# Altium schematic sheet 13_ACODEC.SchDoc: P30L
size A2; Organization: 六零加智能科技; Address4: www.nidone.com.cn; DocumentNumber: kang jin; Revision: 1.0; SheetNumber: 13; SheetTotal: 23
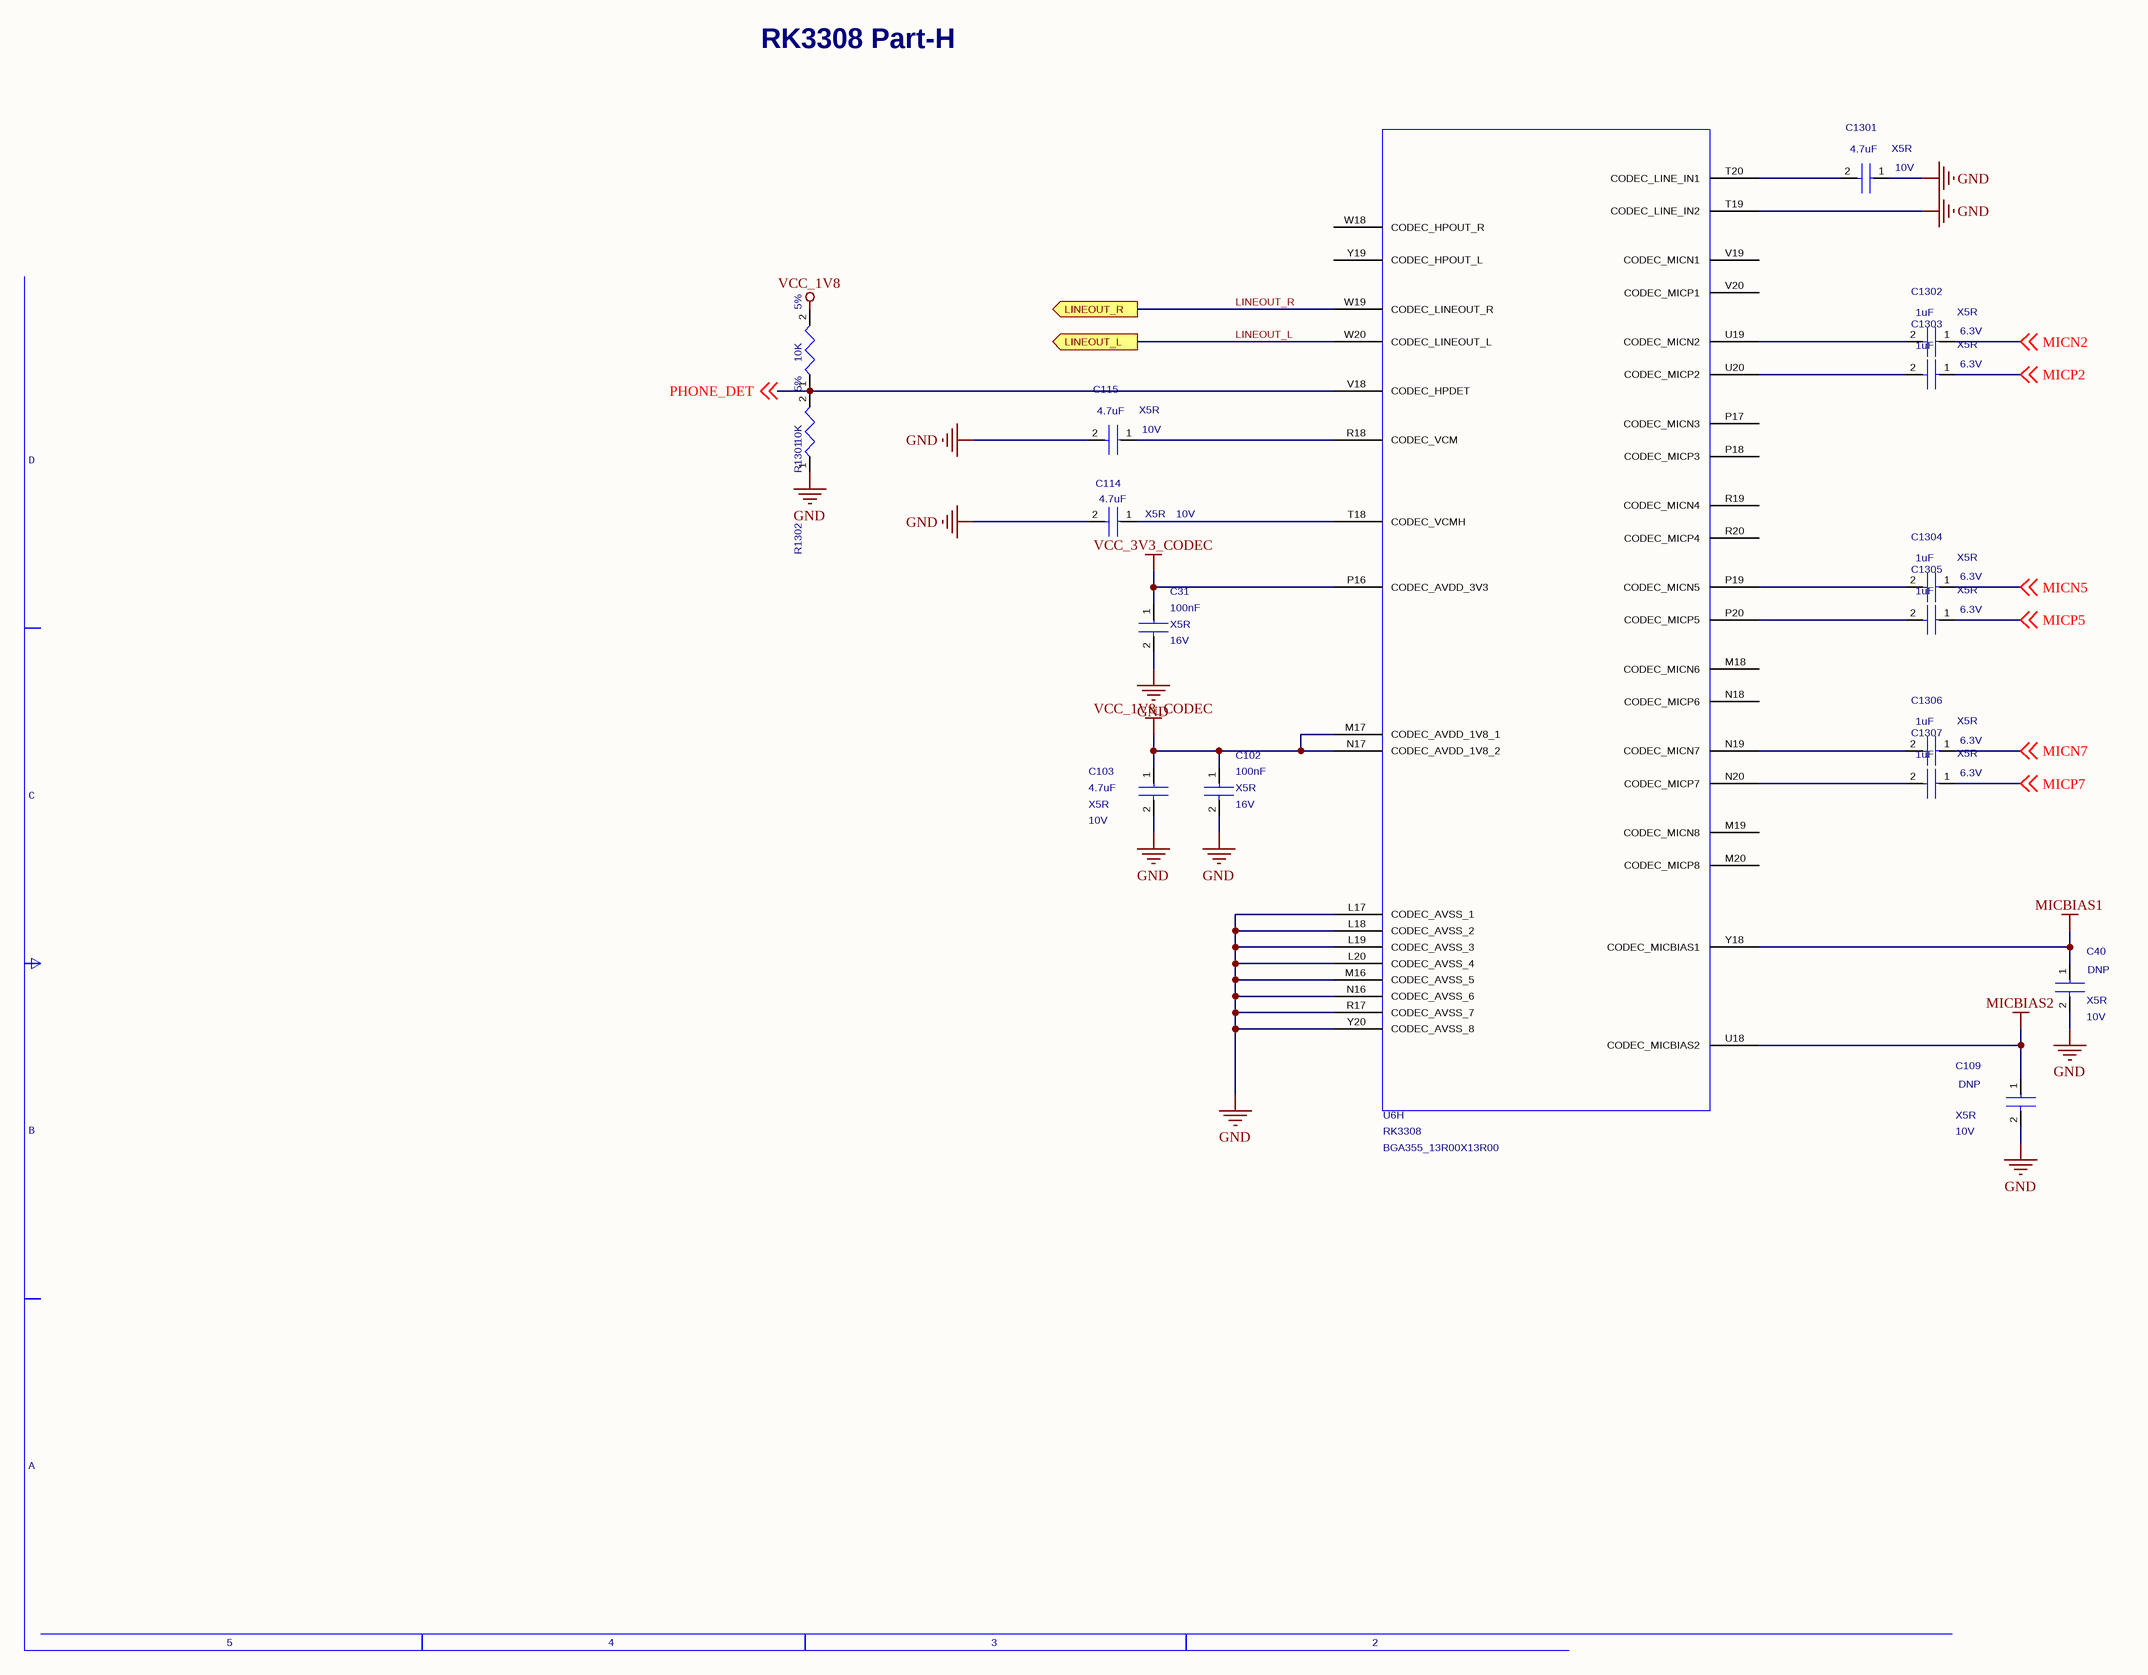
[diagram p0: 13_ACODEC.SchDoc]

## Parts
C31  value 100nF  Voltage: 16V  Dielectric: X5R  [C0402]  (hidden comment: CAP_NP_2)
C40  Dielectric: X5R  Voltage: 10V  Option: DNP  [C0402]  (hidden comment: CAP_NP_2)
C102  value 100nF  Dielectric: X5R  Voltage: 16V  [C0402]  (hidden comment: CAP_NP_2)
C103  value 4.7uF  Dielectric: X5R  Voltage: 10V  [C0402]  (hidden comment: CAP_NP_2)
C109  Voltage: 10V  Dielectric: X5R  Option: DNP  [C0402]  (hidden comment: CAP_NP_2)
C114  value 4.7uF  Voltage: 10V  Dielectric: X5R  [C0603]  (hidden comment: CAP_NP_2)
C115  value 4.7uF  Voltage: 10V  Dielectric: X5R  [C0603]  (hidden comment: CAP_NP_2)
C1301  value 4.7uF  Voltage: 10V  Dielectric: X5R  [C0603]  (hidden comment: CAP_NP_2)
C1302  value 1uF  Voltage: 6.3V  Dielectric: X5R  [C0402]  (hidden comment: CAP_NP_2)
C1303  value 1uF  Voltage: 6.3V  Dielectric: X5R  [C0402]  (hidden comment: CAP_NP_2)
C1304  value 1uF  Voltage: 6.3V  Dielectric: X5R  [C0402]  (hidden comment: CAP_NP_2)
C1305  value 1uF  Voltage: 6.3V  Dielectric: X5R  [C0402]  (hidden comment: CAP_NP_2)
C1306  value 1uF  Voltage: 6.3V  Dielectric: X5R  [C0402]  (hidden comment: CAP_NP_2)
C1307  value 1uF  Voltage: 6.3V  Dielectric: X5R  [C0402]  (hidden comment: CAP_NP_2)
R1301  value 10K  Tolerance: 5%  [R0402]  (hidden comment: RESISTOR)
R1302  value 10K  Tolerance: 5%  [R0402]  (hidden comment: RESISTOR)
U6  RK3308  [BGA355_13R00X13R00]  (part H of 14)

## Ports
LINEOUT_L (out), LINEOUT_R (out)

## Nets
GND: C31.2 C40.2 C102.2 C103.2 C109.2 C114.2 C115.2 C1301.1 R1302.1 U6.L17(CODEC_AVSS_1) U6.L18(CODEC_AVSS_2) U6.L19(CODEC_AVSS_3) U6.L20(CODEC_AVSS_4) U6.M16(CODEC_AVSS_5) U6.N16(CODEC_AVSS_6) U6.R17(CODEC_AVSS_7) U6.T19(CODEC_LINE_IN2) U6.Y20(CODEC_AVSS_8)
MICBIAS1: C40.1 U6.Y18(CODEC_MICBIAS1)
MICBIAS2: C109.1 U6.U18(CODEC_MICBIAS2)
VCC_1V8: R1301.2
VCC_1V8_CODEC: C102.1 C103.1 U6.M17(CODEC_AVDD_1V8_1) U6.N17(CODEC_AVDD_1V8_2)
VCC_3V3_CODEC: C31.1 U6.P16(CODEC_AVDD_3V3)
LINEOUT_L: U6.W20(CODEC_LINEOUT_L) ; port LINEOUT_L
LINEOUT_R: U6.W19(CODEC_LINEOUT_R) ; port LINEOUT_R
MICN2: C1302.1 ; off-sheet MICN2
MICN5: C1304.1 ; off-sheet MICN5
MICN7: C1306.1 ; off-sheet MICN7
MICP2: C1303.1 ; off-sheet MICP2
MICP5: C1305.1 ; off-sheet MICP5
MICP7: C1307.1 ; off-sheet MICP7
PHONE_DET: R1301.1 R1302.2 U6.V18(CODEC_HPDET) ; off-sheet PHONE_DET
NetC114_1: C114.1 U6.T18(CODEC_VCMH)
NetC115_1: C115.1 U6.R18(CODEC_VCM)
NetC1301_2: C1301.2 U6.T20(CODEC_LINE_IN1)
NetC1302_2: C1302.2 U6.U19(CODEC_MICN2)
NetC1303_2: C1303.2 U6.U20(CODEC_MICP2)
NetC1304_2: C1304.2 U6.P19(CODEC_MICN5)
NetC1305_2: C1305.2 U6.P20(CODEC_MICP5)
NetC1306_2: C1306.2 U6.N19(CODEC_MICN7)
NetC1307_2: C1307.2 U6.N20(CODEC_MICP7)

Not connected (* = marked no-connect by the designer): U6 M18(CODEC_MICN6) M19(CODEC_MICN8) M20(CODEC_MICP8) N18(CODEC_MICP6) P17(CODEC_MICN3) P18(CODEC_MICP3) R19(CODEC_MICN4) R20(CODEC_MICP4) V19(CODEC_MICN1) V20(CODEC_MICP1) W18(CODEC_HPOUT_R) Y19(CODEC_HPOUT_L)

## Notes on the sheet
- RK3308 Part-H
- D
- C
- B
- A
- 5
- 4
- 3
- 2
- Title
- Size:
- Date:
- File:
- A2
- Engineer:
- Time:
- Revision:
- Sheet
- of

## Library data of the parts
C31 = CAP_NP_2: cap,100.00nF,+/-10%,16V,X5R,C0402; Manufacturer_PN: C1005X5R1C104K050BA; Manufacturer: TDK; Created_by: JJJ; Tolerance: 10%; Priority: A; Source_Path: Z:\RK_STANDARD_LIBRARY\CADENCE_CIS\RK_DISCRETE.OLB; Number: 1; PCB DECAL: C0402; Part_Type: C0402; RK_PN: C1005X5R1C104K050BA
C40 = CAP_NP_2: cap,1.00uF,+/-10%,10V,X5R,C0402; Manufacturer: TDK; RK_PN: C1005X5R1A105K050BB; Priority: A; Tolerance: 10%; Created_by: JJJ; Source_Path: Z:\RK_STANDARD_LIBRARY\CADENCE_CIS\RK_DISCRETE.OLB; Value: 1uF; Number: 1; PCB DECAL: C0402; Part_Type: C0402; Manufacturer_PN: C1005X5R1A105K050BB
C102 = CAP_NP_2: cap,100.00nF,+/-10%,16V,X5R,C0402; Manufacturer: TDK; RK_PN: C1005X5R1C104K050BA; Priority: A; Tolerance: 10%; Created_by: JJJ; Source_Path: Z:\RK_STANDARD_LIBRARY\CADENCE_CIS\RK_DISCRETE.OLB; Number: 1; PCB DECAL: C0402; Part_Type: C0402; Manufacturer_PN: C1005X5R1C104K050BA
C103 = CAP_NP_2: cap,4.70uF,+/-10%,10V,X5R,C0402; Manufacturer: TDK; RK_PN: C1005X5R1A475K050BC; Priority: A; Tolerance: 10%; Created_by: JJJ; Source_Path: Z:\RK_STANDARD_LIBRARY\CADENCE_CIS\RK_DISCRETE.OLB; Number: 1; PCB DECAL: C0402; Part_Type: C0402; Manufacturer_PN: C1005X5R1A475K050BC
C109 = CAP_NP_2: cap,1.00uF,+/-10%,10V,X5R,C0402; Manufacturer_PN: C1005X5R1A105K050BB; Manufacturer: TDK; Created_by: JJJ; Tolerance: 10%; Priority: A; Source_Path: Z:\RK_STANDARD_LIBRARY\CADENCE_CIS\RK_DISCRETE.OLB; Value: 1uF; Number: 1; PCB DECAL: C0402; Part_Type: C0402; RK_PN: C1005X5R1A105K050BB
C114 C115 C1301 = CAP_NP_2: cap,4.70uF,+/-10%,10V,X5R,C0603; Manufacturer_PN: C1608X5R1A475K080AC; Manufacturer: TDK; Created_by: JJJ; Tolerance: 10%; Priority: A; Source_Path: Z:\RK_STANDARD_LIBRARY\CADENCE_CIS\RK_DISCRETE.OLB; Number: 1; PCB DECAL: C0603; Part_Type: C0603; RK_PN: C1608X5R1A475K080AC
C1302-C1307 = CAP_NP_2: cap,1uF,+/-10%,10V,X5R,C0402; Manufacturer_PN: C1608X5R1A475K080AC; Manufacturer: TDK; Created_by: JJJ; Tolerance: 10%; Priority: A; Source_Path: Z:\RK_STANDARD_LIBRARY\CADENCE_CIS\RK_DISCRETE.OLB; Number: 1; PCB DECAL: C0402; Part_Type: C0402; RK_PN: C1608X5R1A475K080AC
R1301 = RESISTOR: ?用厚膜电阻,2.2K,+/-5%,R0402,1/16W.; Manufacturer: YAGEO; RK_PN: RC0402JR-070RL; Priority: A; Wattage: 1/16W; Created_by: YTL; Source_Path: Z:\RK_STANDARD_LIBRARY\CADENCE_CIS\RK_DISCRETE.OLB; Number: 1; Part_Type: ?用厚膜电阻; Manufacturer_PN: RC0402JR-070RL; PCB DECAL: R0402
R1302 = RESISTOR: ?用厚膜电阻,10K,+/-5%,R0402,1/16W.; Manufacturer: YAGEO; RK_PN: RC0402JR-070RL; Priority: A; Wattage: 1/16W; Created_by: YTL; Source_Path: Z:\RK_STANDARD_LIBRARY\CADENCE_CIS\RK_DISCRETE.OLB; Number: 1; Part_Type: ?用厚膜电阻; Manufacturer_PN: RC0402JR-070RL; PCB DECAL: R0402
U6 = RK3308: Manufacturer: ROCKCHIP; Source_Path: E:\SCHEMETIC\RKSCH.OLB; Number: 1; Manufacturer_PN: RK3308; PCB DECAL: BGA355_13R00X13R00; Value: RK3308